# EasyEDA Pro project 金属疲劳控制系统.eprj

# Schematic Schematic1
Board Name: Board1; Create Date: 2025-07-17; Page Name: P1; Project Name: 金属疲劳控制系统; Schematic Name: Schematic1; Update Date: 2025-08-07; Company: 嘉立创EDA; Page Size: A4; Version: V1.0
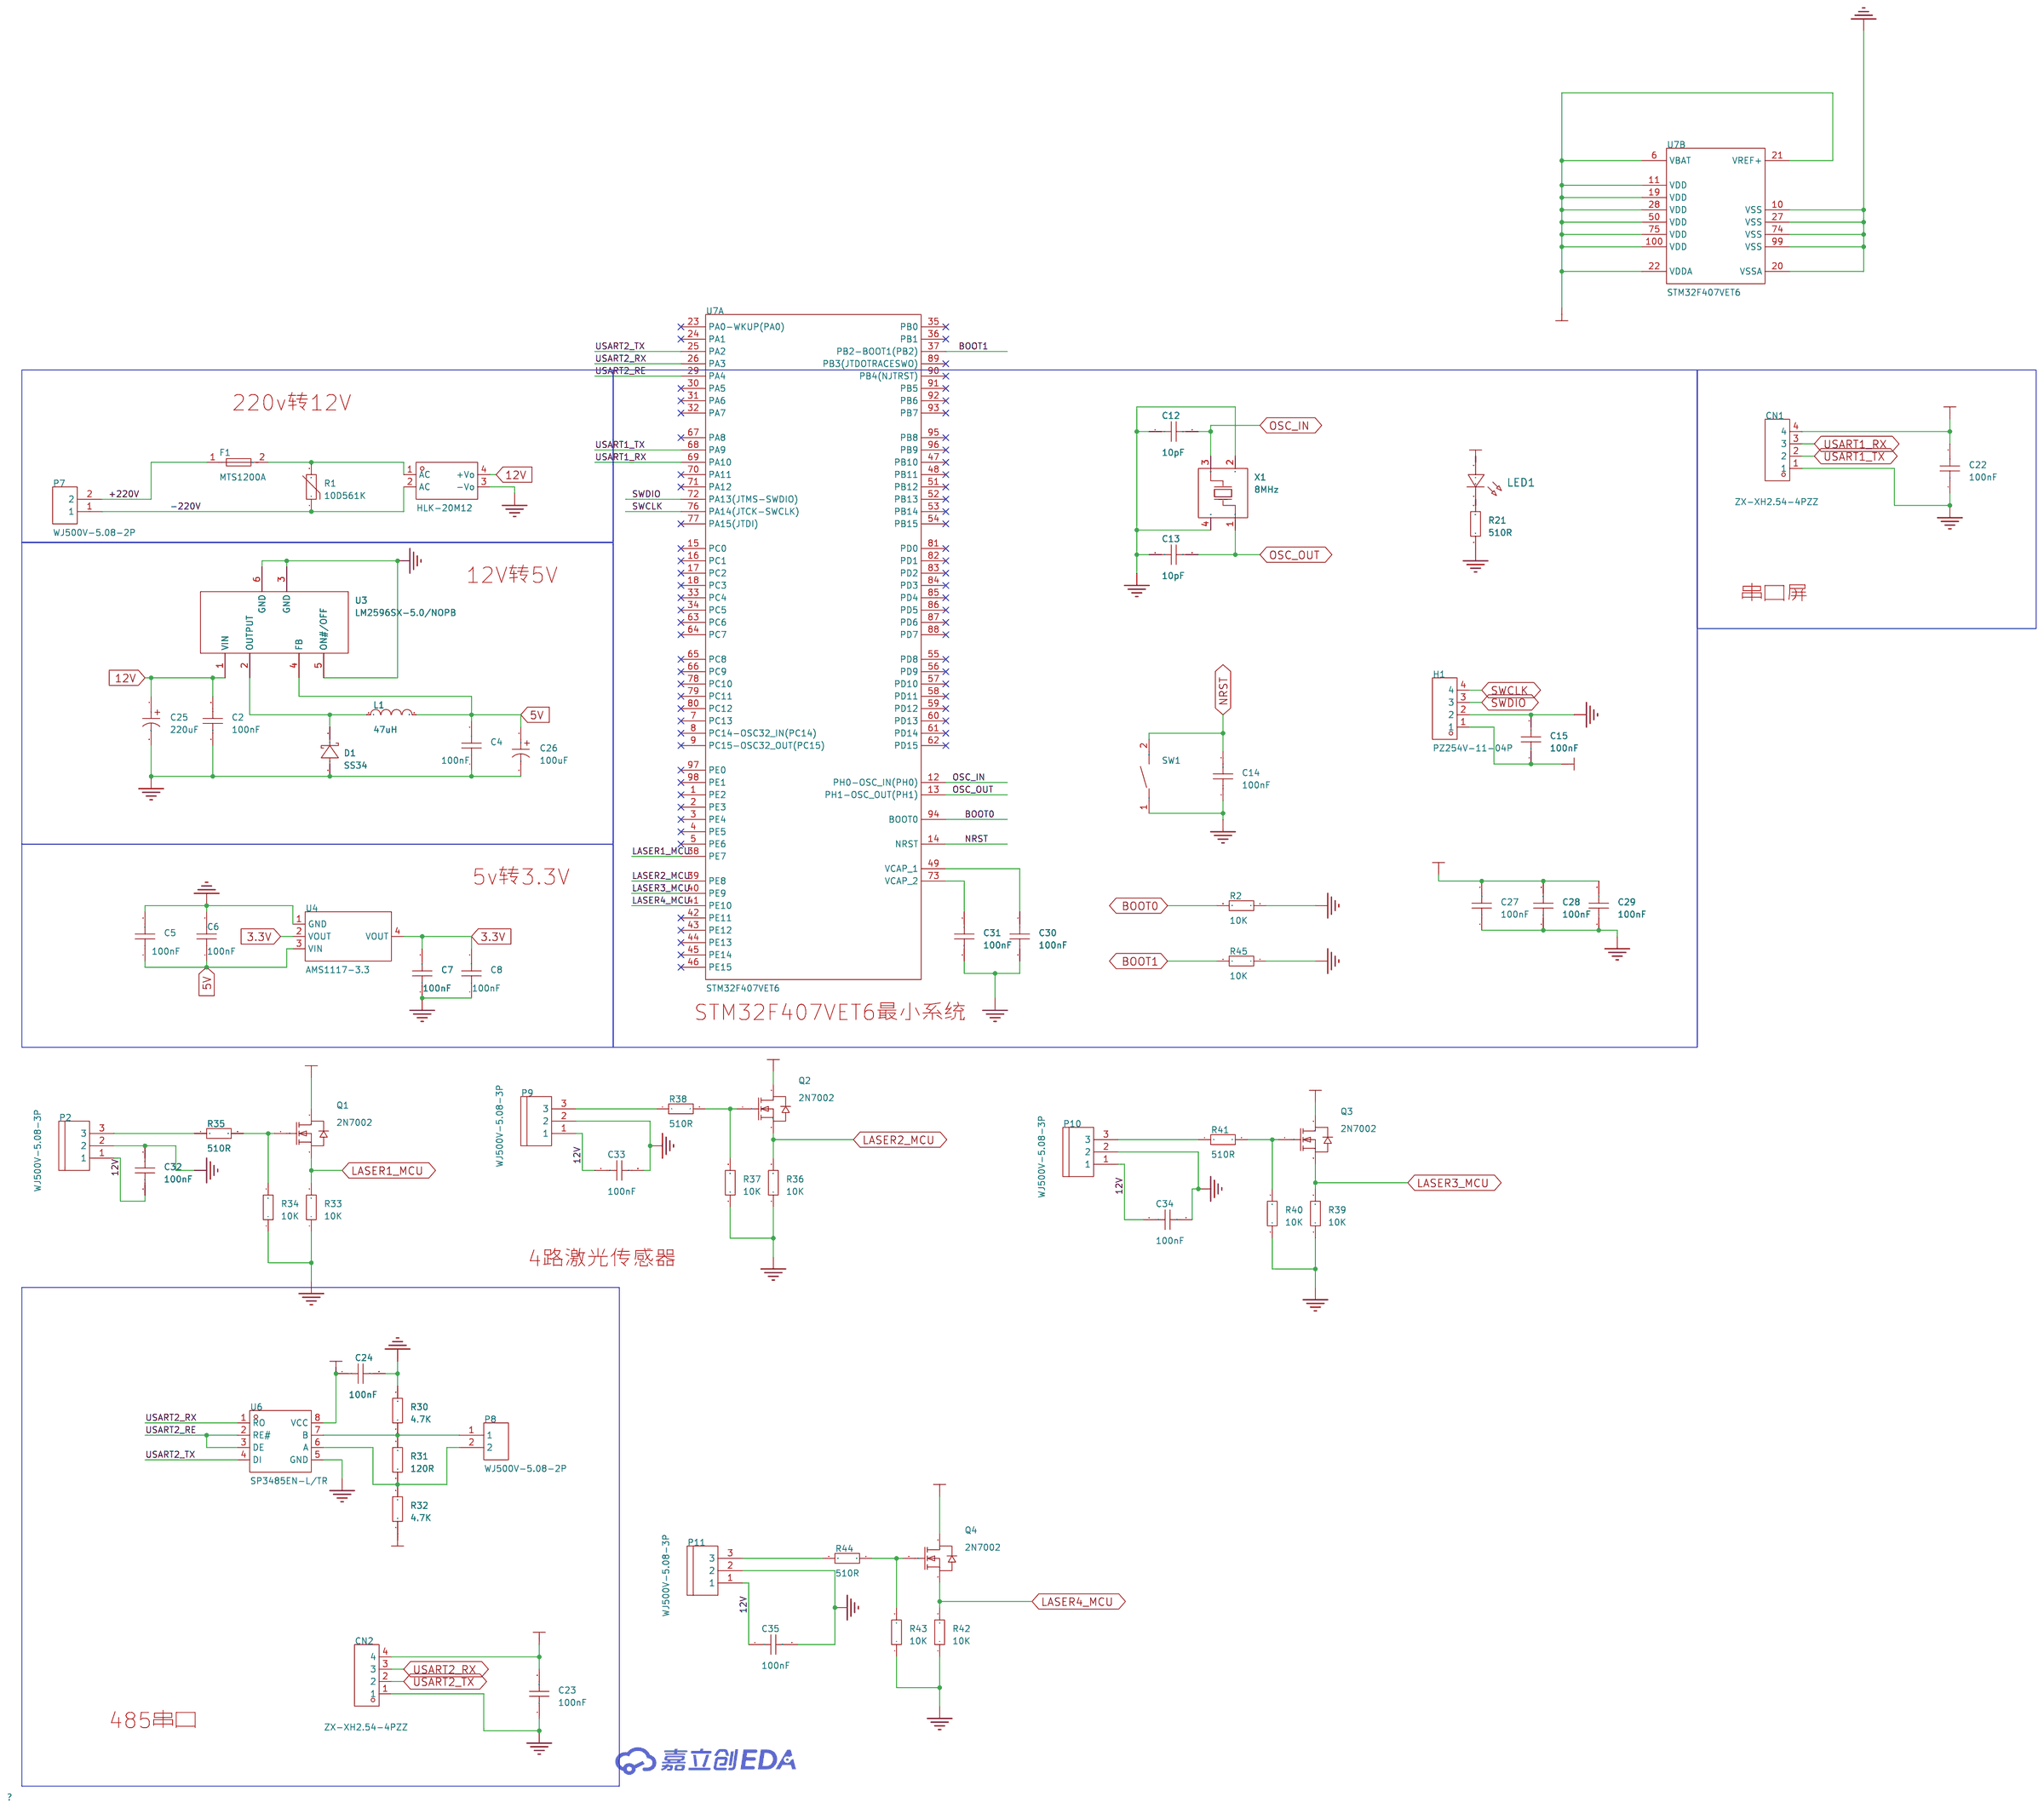
[diagram p0: schematic sheet]

## Parts
C2  100nF  [C0603]
C4  100nF  [C0603]
C5  100nF  [C0603]
C6  100nF  [C0603]
C7  100nF  [C0603]
C8  100nF  [C0603]
C12  10pF  [C0603]
C13  10pF  [C0603]
C14  100nF  [C0603]
C15  100nF  [C0603]
C22  100nF  [C0603]
C23  100nF  [C0603]
C24  100nF  [C0603]
C25  220uF  [CAP-SMD_BD8.0-L8.3-W8.3-FD]
C26  100uF  [CAP-SMD_BD6.3-L6.6-W6.6-FD-1]
C27  100nF  [C0603]
C28  100nF  [C0603]
C29  100nF  [C0603]
C30  100nF  [C0603]
C31  100nF  [C0603]
C32  100nF  [C0603]
C33  100nF  [C0603]
C34  100nF  [C0603]
C35  100nF  [C0603]
CN1  ZX-XH2.54-4PZZ  [CONN-TH_4P-P2.50_4PIN]
CN2  ZX-XH2.54-4PZZ  [CONN-TH_4P-P2.50_4PIN]
D1  SS34  [SMA_L4.3-W2.6-LS5.0-FD]
F1  MTS1200A  [FUSE-TH_L8.4-W4.0-P5.08-D0.6]
H1  PZ254V-11-04P  [HDR-TH_4P-P2.54-V-M]
L1  47uH  [IND-SMD_L12.0-W12.0]
LED1  -  [LED_0603]
P2  WJ500V-5.08-3P  [CONN-TH_3P-P5.00_WJ500V-5.08-3P]
P7  WJ500V-5.08-2P  [CONN-TH_2P-P5.00_WJ500V-5.08-2P]
P8  WJ500V-5.08-2P  [CONN-TH_2P-P5.00_WJ500V-5.08-2P]
P9  WJ500V-5.08-3P  [CONN-TH_3P-P5.00_WJ500V-5.08-3P]
P10  WJ500V-5.08-3P  [CONN-TH_3P-P5.00_WJ500V-5.08-3P]
P11  WJ500V-5.08-3P  [CONN-TH_3P-P5.00_WJ500V-5.08-3P]
Q1  2N7002  [SOT-23-3_L2.9-W1.3-P1.90-LS2.4-BR]
Q2  2N7002  [SOT-23-3_L2.9-W1.3-P1.90-LS2.4-BR]
Q3  2N7002  [SOT-23-3_L2.9-W1.3-P1.90-LS2.4-BR]
Q4  2N7002  [SOT-23-3_L2.9-W1.3-P1.90-LS2.4-BR]
R1  10D561K  [RES-TH_L12.5-W7.0-P7.50-D1.2-S7.00]
R2  10K  [R0603]
R21  510R  [R0603]
R30  4.7K  [R0603]
R31  120R  [R0603]
R32  4.7K  [R0603]
R33  10K  [R0603]
R34  10K  [R0603]
R35  510R  [R0603]
R36  10K  [R0603]
R37  10K  [R0603]
R38  510R  [R0603]
R39  10K  [R0603]
R40  10K  [R0603]
R41  510R  [R0603]
R42  10K  [R0603]
R43  10K  [R0603]
R44  510R  [R0603]
R45  10K  [R0603]
SW1  TS-1088-AR02016  [SW-SMD_L3.9-W3.0-P4.45]
U2  HLK-20M12  [PWRM-TH_HLK-20MXX]
U3  LM2596SX-5.0/NOPB  [TO-263-5_L10.2-W8.9-P1.70-TL]
U4  AMS1117-3.3  [SOT-223-3_L6.5-W3.4-P2.30-LS7.0-BR]
U6  SP3485EN-L/TR  [SOIC-8_L5.0-W4.0-P1.27-LS6.0-BL]
U7  STM32F407VET6  [LQFP-100_L14.0-W14.0-P0.50-LS16.0-BL]  (sections 1,2)
X1  8MHz  [CRYSTAL-SMD_4P-L3.2-W2.5-BL]

## Library data of the parts
C2 C4-C8 C12-C15 C22-C24 C27-C35 = CAP_0603: Supplier Footprint: 0603
C25 = GVT1V227M0810CNVC: 容值:220uF;精度:±20%;额定电压:35V;纹波电流:175mA@120Hz;; LCSC Part Name: 220uF ±20% 35V; Supplier Part: C2983323; Manufacturer: HRK(鸿瑞凯电子); Supplier Footprint: SMD,D8xL10.5mm; JLCPCB Part Class: 扩展库; Datasheet: https://atta.szlcsc.com/upload/public/pdf/source/20220321/BA17E910A44EA2B508CDD6AB8BA576BA.pdf; Supplier: LCSC; Tolerance: ±20%; Rated Voltage: 35V; Ripple Current: 175mA@120Hz; φD: 8mm; L: 10.5mm; Lifetime @ Temp: 2000hrs@105℃; Operating Temperature: -55℃~+105℃
C26 = JVJ25V100M6x5: 容值:100uF;精度:±20%;额定电压:25V;纹波电流:72mA@120Hz;; LCSC Part Name: 100uF ±20% 25V; Supplier Part: C46550402; Manufacturer: 捷而瑞; Supplier Footprint: SMD,D6.3xL5.4mm; JLCPCB Part Class: 扩展库; Datasheet: https://atta.szlcsc.com/upload/public/pdf/source/20250526/372E583B5965CEB57A276EA554306514.pdf; Supplier: LCSC; Tolerance: ±20%; Voltage Rating: 25V; Ripple Current: 72mA@120Hz; Diameter: 6.3mm; Height - Seated (Max): 5.4mm; Lifetime: 2000hrs@105℃; Operating Temperature: -55℃~+105℃
CN1 CN2 = ZX-XH2.54-4PZZ: 插针结构:1x4P;间距:2.5mm;安装方式:直插;参考系列:XH;总PIN数:4P;排数:1;每排PIN数:4;行距:-;额定电流:3A;触头材质:黄铜;触头镀层:锡;工作温度范围:-25℃~+85℃;; LCSC Part Name: 1x4P 间距:2.5mm 直插 系列:XH; Supplier Part: C7429634; Manufacturer: Megastar(兆星); Supplier Footprint: 插件,P=2.5mm; JLCPCB Part Class: 扩展库; Datasheet: https://atta.szlcsc.com/upload/public/pdf/source/20230619/B529A2163E0159A644AB3383D208FB03.pdf; Supplier: LCSC; Pins Structure: 1x4P; Pitch: 2.5mm; Mounting Type: 直插; Reference Series: XH; Number of Pins: 4P; Number of Rows: 1; Number of PINs Per Row: 4; Rated Current: 3A; Contact Material: 黄铜; Contact Plating: 锡; Operating Temperature: -25℃~+85℃; Rated Voltage (Max): 250V; Plastic Material: PA66; Flame Retardant Rating: UL94V-0; Color: 白色; Z-Height of the Board: 7mm; X-Length of Bottom Edge on Board (Spacing Line): 12.5mm; Y-Width of Bottom Edge on Board: 5.9mm
D1 = SS34_C7420365: 二极管配置:独立式;正向压降(Vf):550mV@3.0A;直流反向耐压(Vr):40V;平均整流电流(Io):3A;; LCSC Part Name: 电压:40V 电流:3A; Supplier Part: C7420365; Manufacturer: 宏迦橙; Supplier Footprint: SMA(DO-214AC); JLCPCB Part Class: 扩展库; Datasheet: https://atta.szlcsc.com/upload/public/pdf/source/20230828/75438452AEE6C276EDA92B2AF599BE05.pdf; Supplier: LCSC; Diode Configuration: 独立式; Forward Voltage (Vf@If): 550mV@3.0A; Reverse Voltage (Vr): 40V; Average Rectified Current (Io): 3A; Reverse Leakage Current (Ir): 200uA@40V; Peak forward surge current: 80A
F1 = MTS1200A: 类型:方形保险丝;额定电流:2A;; LCSC Part Name: 方形直插 慢断 250V 2A 保险丝; Supplier Part: C2762406; Manufacturer: Reomax(瑞迈); Supplier Footprint: 插件; JLCPCB Part Class: 扩展库; Datasheet: https://atta.szlcsc.com/upload/public/pdf/source/20210326/C2762413_8528218BDF91E47FC4A01F9F596C0CE3.pdf; Supplier: LCSC; Type: 方形保险丝; Current Rating: 2A
H1 = PZ254V-11-04P: 插针结构:1x4P;间距:2.54mm;行距:-;圆针/方针:方针;安装类型:直插;排数:单排;总PIN位数:4P;额定电流:3A;额定电压:250V;配合针长度:6mm;塑高:2.5mm;端接针长度:3mm;触头材质:-;工作温度范围:-40℃~+105℃;颜色:黑色;; LCSC Part Name: 间距:2.54mm 1x4P 直插 方针; Supplier Part: C2691448; Manufacturer: XFCN(兴飞); Supplier Footprint: 插件,P=2.54mm; JLCPCB Part Class: 扩展库; Datasheet: https://atta.szlcsc.com/upload/public/pdf/source/20200309/C492403_F9F19131791D08044AD4F84F8E751A34.pdf; Supplier: LCSC; Pin Structure: 1x4P; Pitch: 2.54mm; Circluar Pins/Square Pins: 方针; Mounting Type: 直插; Number of Rows: 单排; Number of Pins: 4P; Current Rating (Max): 3A; Voltage Rating (Max): 250V; Length of Mating Pin: 6mm; Insulation Height: 2.5mm; Length of End Connection Pin: 3mm; Operating Temperature Range: -40℃~+105℃; Color: 黑色
L1 = YPRH1209-470M: 电感值:47uH;精度:±20%;额定电流:3.6A;; LCSC Part Name: 47uH ±20%; Supplier Part: C339956; Manufacturer: YJYCOIN(益嘉源); Supplier Footprint: SMD,12x12mm; JLCPCB Part Class: 扩展库; Datasheet: https://atta.szlcsc.com/upload/public/pdf/source/20200623/C339955_D39FA66995A9BB8553FDBD7D9E6E5CB5.pdf; Supplier: LCSC; Tolerance: ±20%; Rated Current: 3.6A; DC Resistance (DCR): 63mΩ
LED1 = LED_0603-R: Supplier Footprint: 0603
P2 P9-P11 = WJ500V-5.08-3P: 结构:1x3P;间距:5.08mm;颜色:绿色;安装方式:直插;额定电流:18A;额定电压:250V;排数:1;线规 - AWG:14~30;线规 - 平方毫米:2.5;每排PIN数:3;工作温度范围:-40℃~+105℃;; LCSC Part Name: 5.08mm 1x3P 排数:1 每排P数:3 直插; Supplier Part: C72334; Manufacturer: KANGNEX(康奈克斯电气); Supplier Footprint: 插件,P=5.08mm; JLCPCB Part Class: 扩展库; Datasheet: https://atta.szlcsc.com/upload/public/pdf/source/20191225/C72334_8A5EF831D67650233B6B1E3F2BC06274.pdf; Supplier: LCSC; Structure: 1x3P; Pitch: 5.08mm; Color: 绿色; Mounting Style: 直插; Current Rating (Max): 18A; Voltage Rating (Max): 250V; Number of Pins: 3P; Number of Rows: 1; Wire Gauge - AWG: 14~30; Wire Gauge - mm2: 2.5; Number of PINs Per Row: 3; Operating Temperature Range: -40℃~+105℃
P7 P8 = WJ500V-5.08-2P: 结构:1x2P;间距:5.08mm;颜色:绿色;安装方式:直插;额定电流:18A;额定电压:250V;排数:1;线规 - AWG:14~30;线规 - 平方毫米:2.5;每排PIN数:2;触头材质:-;触头镀层:-;工作温度范围:-40℃~+105℃;焊接温度(最大值):-;; LCSC Part Name: 1x2P 5.08mm 直插 排数:1 每排P数:2; Supplier Part: C8465; Manufacturer: KANGNEX(康奈克斯电气); Supplier Footprint: 插件,P=5.08mm; JLCPCB Part Class: 扩展库; Datasheet: https://atta.szlcsc.com/upload/public/pdf/source/20191225/C8465_02D34CE5B5B4A53DF5891601D97FA9F4.pdf; Supplier: LCSC; Structure: 1x2P; Pitch: 5.08mm; Color: 绿色; Mounting Style: 直插; Current Rating (Max): 18A; Voltage Rating (Max): 250V; Number of Pins: 2P; Number of Rows: 1; Wire Gauge - AWG: 14~30; Wire Gauge - mm2: 2.5; Number of PINs Per Row: 2; Operating Temperature Range: -40℃~+105℃; Screw Specification: M2.5
Q1-Q4 = 2N7002_C7420321: 数量:1个N沟道;漏源电压(Vdss):60V;连续漏极电流(Id):115mA;导通电阻(RDS(on)):900mΩ@10V;耗散功率(Pd):225mW;阈值电压(Vgs(th)):1.6V@250uA;; LCSC Part Name: N沟道,电流:115mA,耐压:60V; Supplier Part: C7420321; Manufacturer: 宏嘉诚; Supplier Footprint: SOT-23; JLCPCB Part Class: 扩展库; Datasheet: https://atta.szlcsc.com/upload/public/pdf/source/20250624/B1032C791A504786E484C5C5C9138B03.pdf; Supplier: LCSC; Number: 1个N沟道; Drain to Source Voltage: 60V; Current - Continuous Drain(Id): 115mA; RDS(on): 900mΩ@10V; Pd - Power Dissipation: 225mW; Gate Threshold Voltage (Vgs(th)): 1.6V@250uA; Gate Charge(Qg): 1.6nC@10V; Input Capacitance(Ciss): 50pF; Reverse Transfer Capacitance (Crss@Vds): 5pF; Operating Temperature: -55℃~+150℃; Type: N沟道; Output Capacitance(Coss): 25pF
R1 = 10D561K_C233178: 压敏电压:504V~616V;钳位电压:920V;最大工作电压(DC):460V;最大工作电压(AC):350V;; LCSC Part Name: 钳位电压920V 42.3焦耳 插件压敏电阻; Supplier Part: C233178; Manufacturer: RUILON(瑞隆源); Supplier Footprint: 插件; JLCPCB Part Class: 扩展库; Datasheet: https://atta.szlcsc.com/upload/public/pdf/source/20180619/C233186_9A7AF57C0A178A4DEED9AC3F9621CA64.pdf; Supplier: LCSC; Varistor Voltage: 504V~616V; Clamping Voltage: 920V; Allowable Voltage (DC): 460V; Allowable Voltage (AC): 350V; Peak Current: 2.5kA; Maximum Energy: 42.3J; Typical Capatitance: 180pF@1kHz
R2 R21 R30-R45 = Res_0603: Supplier Footprint: 0603
SW1 = TS-1088-AR02016: 电路结构:单刀单掷;按钮形状:圆形按钮;作用力:160gf;安装方式:立贴;开关长度:4mm;开关宽度:3mm;开关高度:2mm;带支架:不带;触点电流:50mA;额定电压(DC):12V;绝缘电阻:100MΩ;机械寿命:10万次;; LCSC Part Name: 4*3*2mm 立贴 轻触开关; Supplier Part: C720477; Manufacturer: XUNPU(讯普); Supplier Footprint: SMD; JLCPCB Part Class: 基础库; Datasheet: https://atta.szlcsc.com/upload/public/pdf/source/20200810/C720475_60D09DD6C54279ADDB2DC25100F1CC11.pdf; Supplier: LCSC; Circuit: 单刀单掷; Actuator Style: 圆形按钮; Operating Force: 160gf; Mounting Style: 立贴; Switch Length: 4mm; Switch Width: 3mm; Switch Height: 2mm; Strike Gundam: 不带; Contact Current: 50mA; Voltage Rating (DC): 12V; Insulation Resistance: 100MΩ; Actuator/Cap Color: 黑色; Pin Style: SMD接片; Mechanical Life: 10万次; Operating Temperature: -30℃~+80℃
U2 = HLK-20M12: Supplier Part: C465408; Manufacturer: HI-LINK(海凌科); Supplier Footprint: 插件; JLCPCB Part Class: 扩展库; Datasheet: https://atta.szlcsc.com/upload/public/pdf/source/20191129/C465408_B4DB32B760893889245A0754E253364E.pdf; Supplier: LCSC
U3 = LM2596SX-5.0/NOPB: 功能类型:降压型;输出类型:固定;工作电压:4.5V~40V;输出电压:5V;输出电流:3A;; LCSC Part Name: LM2596 SIMPLE SWITCHER® 3A 降压电压调节器; Supplier Part: C10002; Manufacturer: TI(德州仪器); Supplier Footprint: TO-263-5; JLCPCB Part Class: 扩展库; Datasheet: https://www.ti.com/cn/lit/gpn/lm2596; Supplier: LCSC; Function: 降压型; Output Type: 固定; Voltage - Supply: 4.5V~40V; Output Voltage: 5V; Output Current: 3A; Frequency - Switching: 150kHz; Operating Temperature: -40℃~+125℃@(TJ); Synchronous Rectifier: 否; Number of Outputs: 1; Topology: 降压式; Switch tube (built-in/external): 内置
U4 = AMS1117-3.3_C6186: 输出类型:固定;工作电压:16V;输出电压:3.3V;输出电流:1A;电源纹波抑制比(PSRR):72dB@(120Hz);输出极性:正极;; LCSC Part Name: 输出3.3V 1A; Supplier Part: C6186; Manufacturer: AMS; Supplier Footprint: SOT-223; JLCPCB Part Class: 基础库; Datasheet: https://atta.szlcsc.com/upload/public/pdf/source/20180727/C6186_7A095716F0823C02F1997A905E26C086.pdf; Supplier: LCSC; Output Type: 固定; Voltage - Supply: 16V; Output Voltage: 3.3V; Output Current: 1A; Power Supply Rejection Ratio (PSRR): 72dB@(120Hz); Voltage Dropout: 1.1V@(800mA); standby current: 5mA; Features: 过流保护；过热保护; Operating Temperature: -40℃~+125℃; Output Configuration: 正极; Number of Outputs: 1
U6 = SP3485EN-L/TR: 类型:收发器;数据速率:10Mbps;; LCSC Part Name: SP3485 +3.3V低功耗半双工RS-485收发器，数据速率10Mbps; Supplier Part: C8963; Manufacturer: MaxLinear(迈凌); Supplier Footprint: SOIC-8; JLCPCB Part Class: 基础库; Datasheet: https://atta.szlcsc.com/upload/public/pdf/source/20170601/1496285796963.pdf; Supplier: LCSC; Types: 收发器; Number of Driver: 1; Number of receiver: 1; Supply Voltage: 3.3V; Data Rate: 10Mbps; Operating Temperature: -40℃~+85℃
U7 = STM32F407VET6: CPU内核:ARM-M4;CPU最大主频:168MHz;应用领域:-;; LCSC Part Name: 带DSP和FPU的高性能基础系列ARM Cortex-M4 MCU，具有512 KB Flash、168 MHz CPU、ART加速器、以太网和FSMC; Supplier Part: C28730; Manufacturer: ST(意法半导体); Supplier Footprint: LQFP-100(14x14); JLCPCB Part Class: 扩展库; Datasheet: https://atta.szlcsc.com/upload/public/pdf/source/20140801/1457707197138.pdf; Supplier: LCSC; CPU Core: ARM-M4; CPU Maximum Speed: 168MHz; Program Storage Size: 512KB; Program Memory Type: FLASH; Number of I/O: 82; ADC (Bit): 12bit; DAC (Bit): 12bit; Voltage - Supply: 1.8V~3.6V
X1 = X322525MOB4SI: 晶振类型:贴片晶振;频率:25MHz;常温频差:±10ppm;负载电容:12pF;频率稳定度:±20ppm;; LCSC Part Name: YSX321SL 25MHZ 4P 3225 12PF ±10PPM -40~85℃ (±20PPM); Supplier Part: C9006; Manufacturer: YXC(扬兴晶振); Supplier Footprint: SMD3225-4P; JLCPCB Part Class: 基础库; Datasheet: https://atta.szlcsc.com/upload/public/pdf/source/20240329/19D5F850207469550BEB00D7DFEDBC7A.pdf; Supplier: LCSC; Type: 贴片晶振; Normal temperature Frequency Tolerance: ±10ppm; Load Capacitance: 12pF; Frequency Stability: ±20ppm; Operating Temperature: -40℃~+85℃

## Nets
3.3V: C7.2 C8.2 C15.1 C23.2 C24.1 C27.2 C28.2 C29.2 CN2.4 H1.1 LED1.2(A) Q1.3(D) Q2.3(D) Q3.3(D) Q4.3(D) R32.1 U4.2(VOUT) U4.4(VOUT) U6.8(VCC) U7.6(VBAT) U7.11(VDD) U7.19(VDD) U7.21(VREF+) U7.22(VDDA) U7.28(VDD) U7.50(VDD) U7.75(VDD) U7.100(VDD)
5V: C4.2 C5.1 C6.1 C22.2 C26.1 CN1.4 L1.2 U3.4(FB) U4.3(VIN)
12V: C2.2 C25.1 C32.2 C33.1 C34.1 C35.1 P2.1 P9.1 P10.1 P11.1 U2.4(+Vo) U3.1(VIN)
+220V: F1.1 P7.2
-220V: P7.1 R1.1 U2.2(AC)
GND: C2.1 C4.1 C5.2 C6.2 C7.1 C8.1 C12.1 C13.1 C14.1 C15.2 C22.1 C23.1 C24.2 C25.2 C26.2 C27.1 C28.1 C29.1 C30.2 C31.2 C32.1 C33.2 C34.2 C35.2 CN1.1 CN2.1 D1.1(A) H1.2 P2.2 P9.2 P10.2 P11.2 R2.1 R21.1 R30.2 R33.1 R34.1 R36.1 R37.1 R39.1 R40.1 R42.1 R43.1 R45.1 SW1.1 U2.3(-Vo) U3.3(GND) U3.5(ON#/OFF) U3.6(GND) U4.1(GND) U6.5(GND) U7.10(VSS) U7.20(VSSA) U7.27(VSS) U7.74(VSS) U7.99(VSS) X1.2(GND) X1.4(GND)
BOOT0: R2.2 U7.94(BOOT0)
BOOT1: R45.2 U7.37(PB2-BOOT1(PB2))
LASER1_MCU: Q1.2(S) R33.2 U7.38(PE7)
LASER2_MCU: Q2.2(S) R36.2 U7.39(PE8)
LASER3_MCU: Q3.2(S) R39.2 U7.40(PE9)
LASER4_MCU: Q4.2(S) R42.2 U7.41(PE10)
NRST: C14.2 SW1.2 U7.14(NRST)
OSC_IN: C12.2 U7.12(PH0-OSC_IN(PH0)) X1.3(OSC2)
OSC_OUT: C13.2 U7.13(PH1-OSC_OUT(PH1)) X1.1(OSC1)
SWCLK: H1.4 U7.76(PA14(JTCK-SWCLK))
SWDIO: H1.3 U7.72(PA13(JTMS-SWDIO))
USART1_RX: CN1.3 U7.69(PA10)
USART1_TX: CN1.2 U7.68(PA9)
USART2_RE: U6.2(RE#) U6.3(DE) U7.29(PA4)
USART2_RX: CN2.3 U6.1(RO) U7.26(PA3)
USART2_TX: CN2.2 U6.4(DI) U7.25(PA2)
$1N1339: D1.2(K) L1.1 U3.2(OUTPUT)
$1N1822: F1.2 R1.2 U2.1(AC)
$1N5946: LED1.1(C) R21.2
$1N7709: P8.1 R30.1 R31.2 U6.7(B)
$1N7715: P8.2 R31.1 R32.2 U6.6(A)
$1N12949: P2.3 R35.1
$1N12954: Q1.1(G) R34.2 R35.2
$1N13186: P9.3 R38.1
$1N13193: Q2.1(G) R37.2 R38.2
$1N13466: P10.3 R41.1
$1N13473: Q3.1(G) R40.2 R41.2
$1N13948: Q4.1(G) R43.2 R44.2
$1N13952: P11.3 R44.1
$1N15549: C31.1 U7.73(VCAP_2)
$1N15554: C30.1 U7.49(VCAP_1)

Not connected (* = marked no-connect by the designer): U7 1(PE2)* 2(PE3)* 3(PE4)* 4(PE5)* 5(PE6)* 7(PC13)* 8(PC14-OSC32_IN(PC14))* 9(PC15-OSC32_OUT(PC15))* 15(PC0)* 16(PC1)* 17(PC2)* 18(PC3)* 23(PA0-WKUP(PA0))* 24(PA1)* 30(PA5)* 31(PA6)* 32(PA7)* 33(PC4)* 34(PC5)* 35(PB0)* 36(PB1)* 42(PE11)* 43(PE12)* 44(PE13)* 45(PE14)* 46(PE15)* 47(PB10)* 48(PB11)* 51(PB12)* 52(PB13)* 53(PB14)* 54(PB15)* 55(PD8)* 56(PD9)* 57(PD10)* 58(PD11)* 59(PD12)* 60(PD13)* 61(PD14)* 62(PD15)* 63(PC6)* 64(PC7)* 65(PC8)* 66(PC9)* 67(PA8)* 70(PA11)* 71(PA12)* 77(PA15(JTDI))* 78(PC10)* 79(PC11)* 80(PC12)* 81(PD0)* 82(PD1)* 83(PD2)* 84(PD3)* 85(PD4)* 86(PD5)* 87(PD6)* 88(PD7)* 89(PB3(JTDOTRACESWO))* 90(PB4(NJTRST))* 91(PB5)* 92(PB6)* 93(PB7)* 95(PB8)* 96(PB9)* 97(PE0)* 98(PE1)*

## Notes on the sheet
- 220v转12V
- 12V转5V
- 串口屏
- 5v转3.3V
- STM32F407VET6最小系统
- 4路激光传感器
- 485串口

# Board PCB1
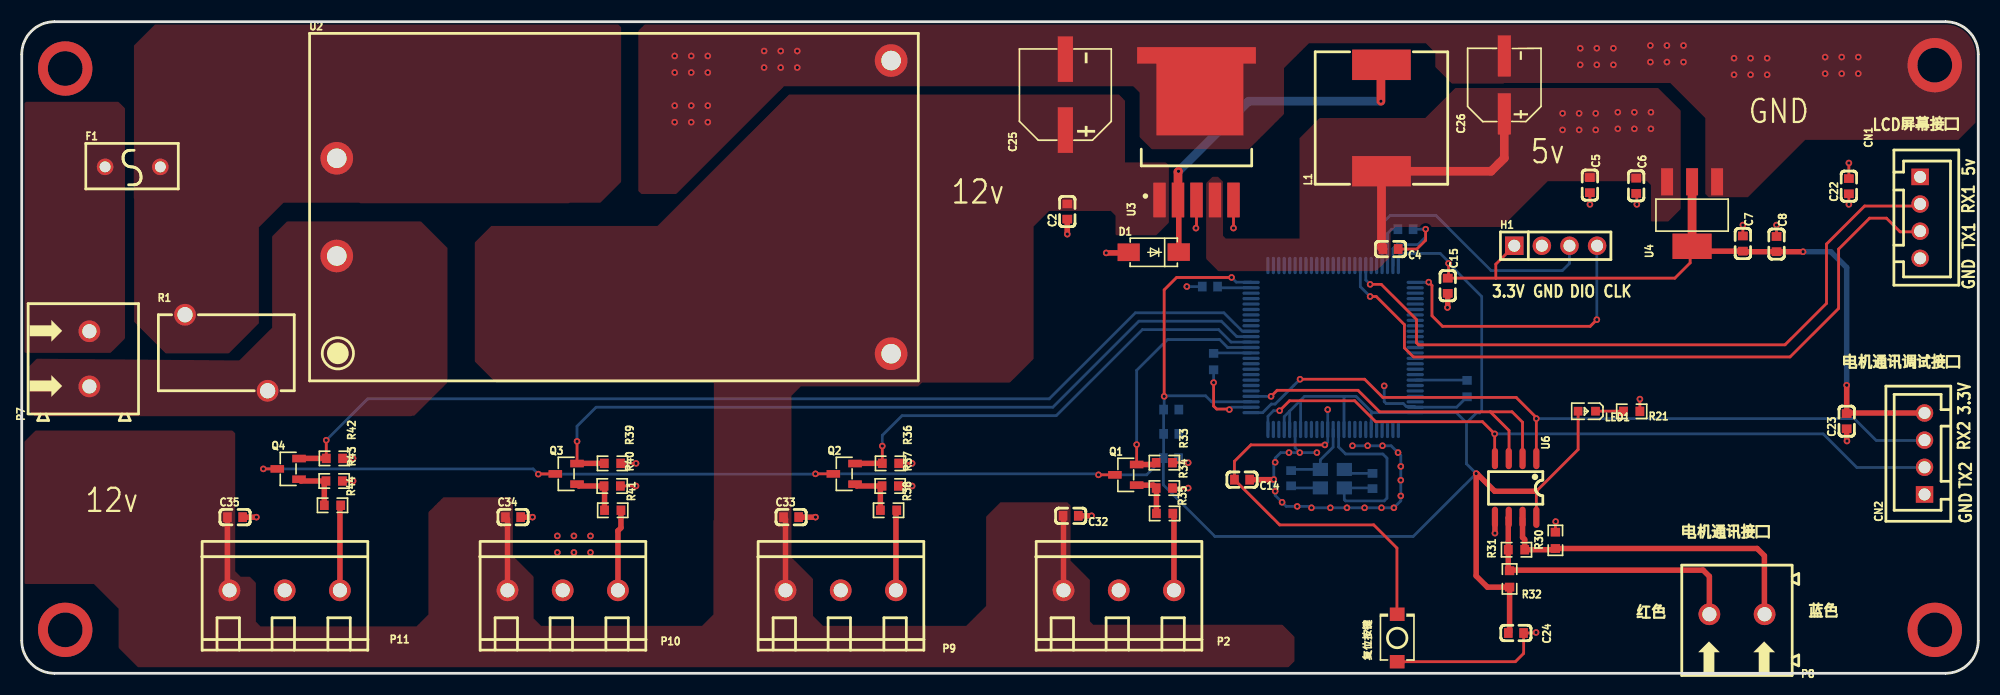
[diagram p1: board, top side]
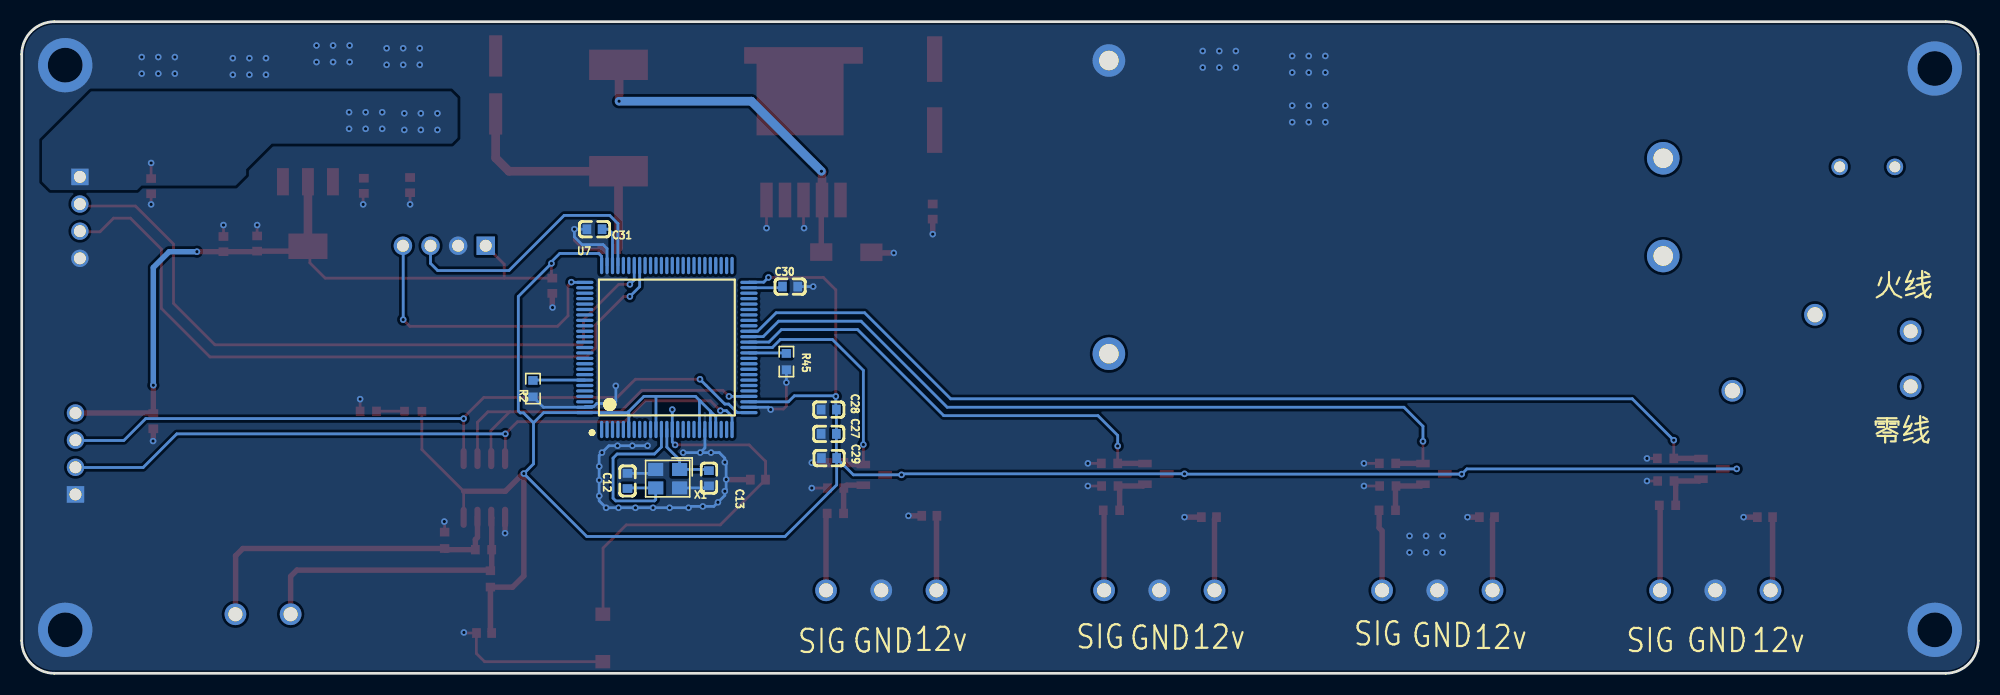
[diagram p2: board, bottom side, seen from below]

Outline 180 x 60 mm; copper layers: Top Layer, Bottom Layer. Coordinates in mm from the lower left corner of the outline.
Outline path: 0,57 0,3 arc(0.88,0.88) 3,0 177,0 arc(179.12,0.88) 180,3 180,57 arc(179.12,59.12) 177,60 3,60 arc(0.88,59.12) 0,57
Stack: Top Layer 0.035mm / Dielectric1 1.51mm FR4 er 4.5 / Bottom Layer 0.035mm

## Design rules (mm)
template: 自定义配置
spacing copperThickness1oz (default): track to track 0.102, other pairs 0.152 to 0.3
spacing copperThickness2oz: track to track 0.203, other pairs 0.152 to 0.3
track width copperThickness1oz (default): min 0.127, default 0.254, max 0.8
track width copperThickness2oz: min 0.203, default 0.254, max 10
differential pair differentialPair (default): width min 0.127, default 0.254, max 2.54; gap min 0.152, default 0.152
via viaSize (default): diameter min 0.5, default 0.61, max 10; hole min 0.3, default 0.305, max 6.3

## Placement (name value [footprint] x y rotation side)
C2  100nF  [C0603]  96.19 42.52 90 top
C4  100nF  [C0603]  125.93 39.06 180 top
C5  100nF  [C0603]  144.27 44.95 270 top
C6  100nF  [C0603]  148.53 44.89 270 top
C7  100nF  [C0603]  158.34 39.57 270 top
C8  100nF  [C0603]  161.44 39.52 270 top
C12  10pF  [C0603]  124.27 17.71 270 bottom
C13  10pF  [C0603]  116.78 17.96 90 bottom
C14  100nF  [C0603]  112.27 17.83 180 top
C15  100nF  [C0603]  131.19 35.69 270 top
C22  100nF  [C0603]  168.1 44.86 90 top
C23  100nF  [C0603]  167.89 23.22 90 top
C24  100nF  [C0603]  137.47 3.71 0 top
C25  220uF  [CAP-SMD_BD8.0-L8.3-W8.3-FD]  96.01 53.29 90 top
C26  100uF  [CAP-SMD_BD6.3-L6.6-W6.6-FD-1]  136.4 54.18 90 top
C27  100nF  [C0603]  105.75 22.05 180 bottom
C28  100nF  [C0603]  105.75 24.28 180 bottom
C29  100nF  [C0603]  105.73 19.81 180 bottom
C30  100nF  [C0603]  109.31 35.61 180 bottom
C31  100nF  [C0603]  127.31 40.89 0 bottom
C32  100nF  [C0603]  96.5 14.5 180 top
C33  100nF  [C0603]  70.78 14.38 0 top
C34  100nF  [C0603]  45.2 14.38 0 top
C35  100nF  [C0603]  19.62 14.38 0 top
CN1  ZX-XH2.54-4PZZ  [CONN-TH_4P-P2.50_4PIN]  174.65 41.96 270 top
CN2  ZX-XH2.54-4PZZ  [CONN-TH_4P-P2.50_4PIN]  175.06 20.22 90 top
D1  SS34  [SMA_L4.3-W2.6-LS5.0-FD]  104.14 38.78 0 top
F1  MTS1200A  [FUSE-TH_L8.4-W4.0-P5.08-D0.6]  10.21 46.63 0 top
H1  PZ254V-11-04P  [HDR-TH_4P-P2.54-V-M]  141.12 39.37 0 top
L1  47uH  [IND-SMD_L12.0-W12.0]  125.09 51.13 90 top
LED1  -  [LED_0603]  143.94 24.13 180 top
P2  WJ500V-5.08-3P  [CONN-TH_3P-P5.00_WJ500V-5.08-3P]  100.92 7.64 0 top
P7  WJ500V-5.08-2P  [CONN-TH_2P-P5.00_WJ500V-5.08-2P]  6.22 28.96 90 top
P8  WJ500V-5.08-2P  [CONN-TH_2P-P5.00_WJ500V-5.08-2P]  157.8 5.44 180 top
P9  WJ500V-5.08-3P  [CONN-TH_3P-P5.00_WJ500V-5.08-3P]  75.35 7.64 0 top
P10  WJ500V-5.08-3P  [CONN-TH_3P-P5.00_WJ500V-5.08-3P]  49.77 7.64 0 top
P11  WJ500V-5.08-3P  [CONN-TH_3P-P5.00_WJ500V-5.08-3P]  24.19 7.64 0 top
Q1  2N7002  [SOT-23-3_L2.9-W1.3-P1.90-LS2.4-BR]  101.57 18.27 0 top
Q2  2N7002  [SOT-23-3_L2.9-W1.3-P1.90-LS2.4-BR]  75.67 18.36 0 top
Q3  2N7002  [SOT-23-3_L2.9-W1.3-P1.90-LS2.4-BR]  50.09 18.36 0 top
Q4  2N7002  [SOT-23-3_L2.9-W1.3-P1.90-LS2.4-BR]  24.51 18.82 0 top
R1  10D561K  [RES-TH_L12.5-W7.0-P7.50-D1.2-S7.00]  18.82 29.52 0 top
R2  10K  [R0603]  132.97 26.21 90 bottom
R21  510R  [R0603]  148.12 24.12 180 top
R30  4.7K  [R0603]  141.1 12.24 90 top
R31  120R  [R0603]  137.52 11.38 0 top
R32  4.7K  [R0603]  136.88 8.69 90 top
R33  10K  [R0603]  105.12 19.39 180 top
R34  10K  [R0603]  105.12 17.05 180 top
R35  510R  [R0603]  105.14 14.72 180 top
R36  10K  [R0603]  79.92 19.33 180 top
R37  10K  [R0603]  79.9 17.25 180 top
R38  510R  [R0603]  79.75 15.01 180 top
R39  10K  [R0603]  54.35 19.33 180 top
R40  10K  [R0603]  54.32 17.25 180 top
R41  510R  [R0603]  54.37 15.01 180 top
R42  10K  [R0603]  28.77 19.79 180 top
R43  10K  [R0603]  28.74 17.7 180 top
R44  510R  [R0603]  28.59 15.47 180 top
R45  10K  [R0603]  109.65 28.7 90 bottom
U2  HLK-20M12  [PWRM-TH_HLK-20MXX]  54.48 42.93 0 top
U3  LM2596SX-5.0/NOPB  [TO-263-5_L10.2-W8.9-P1.70-TL]  108.08 48.59 90 top
U4  AMS1117-3.3  [SOT-223-3_L6.5-W3.4-P2.30-LS7.0-BR]  153.67 42.29 90 top
U6  SP3485EN-L/TR  [SOIC-8_L5.0-W4.0-P1.27-LS6.0-BL]  137.44 17.07 180 top
U7  STM32F407VET6  [LQFP-100_L14.0-W14.0-P0.50-LS16.0-BL]  120.65 30 180 bottom
X1  8MHz  [CRYSTAL-SMD_4P-L3.2-W2.5-BL]  120.57 17.92 0 bottom
复位按键  TS-1088-AR02016  [SW-SMD_L3.9-W3.0-P4.45]  126.54 3.25 90 top

## Footprints (pads in the part's own frame, mm; a bottom-side part is the same pattern mirrored in y, then rotated)
C0603
  rect 0.8x0.9 smd: 1(-0.7,0) 2(0.7,0)
CAP-SMD_BD6.3-L6.6-W6.6-FD-1
  rect 3.8x1.2 smd: 1(-2.67,0) 2(2.67,0)
CAP-SMD_BD8.0-L8.3-W8.3-FD
  rect 4.2x1.4 smd: 1(-3.267,0) 2(3.267,0)
CONN-TH_2P-P5.00_WJ500V-5.08-2P
  round 2 hole 1.3: 1(-2.54,0) 2(2.54,0)
CONN-TH_3P-P5.00_WJ500V-5.08-3P
  round 2 hole 1.3: 1(-5.08,0) 2(0,0) 3(5.08,0)
CONN-TH_4P-P2.50_4PIN
  rect 1.524x1.6 hole 1.1: 1(-3.75,0)
  round 1.6 hole 1.1: 2(-1.25,0) 3(1.25,0) 4(3.75,0)
CRYSTAL-SMD_4P-L3.2-W2.5-BL
  rect 1.4x1.2 smd: 1(-1.1,-0.85) 2(1.1,-0.85) 3(1.1,0.85) 4(-1.1,0.85)
FUSE-TH_L8.4-W4.0-P5.08-D0.6
  round 1.524 hole 1: 1(-2.54,0) 2(2.54,0)
HDR-TH_4P-P2.54-V-M
  rect 1.7x1.7 hole 1.1: 1(-3.81,0)
  round 1.7 hole 1.1: 2(-1.27,0) 3(1.27,0) 4(3.81,0)
IND-SMD_L12.0-W12.0
  rect 2.8x5.4 smd: 1(4.9,0) 2(-4.9,0)
LED_0603
  rect 0.8x0.8 smd: 1(-0.851,-0.01) 2(0.75,-0.005)
LQFP-100_L14.0-W14.0-P0.50-LS16.0-BL
  oval 0.3x1.6 smd: 1(-6,-7.55) 2(-5.5,-7.55) 3(-5,-7.55) 4(-4.5,-7.55) 5(-4,-7.55) 6(-3.5,-7.55) 7(-3,-7.55) 8(-2.5,-7.55) 9(-2,-7.55) 10(-1.5,-7.55) 11(-1,-7.55) 12(-0.5,-7.55) 13(0,-7.55) 14(0.5,-7.55) 15(1,-7.55) 16(1.5,-7.55) 17(2,-7.55) 18(2.5,-7.55) 19(3,-7.55) 20(3.5,-7.55) 21(4,-7.55) 22(4.5,-7.55) 23(5,-7.55) 24(5.5,-7.55) 25(6,-7.55) 51(6,7.55) 52(5.5,7.55) 53(5,7.55) 54(4.5,7.55) 55(4,7.55) 56(3.5,7.55) 57(3,7.55) 58(2.5,7.55) 59(2,7.55) 60(1.5,7.55) 61(1,7.55) 62(0.5,7.55) 63(0,7.55) 64(-0.5,7.55) 65(-1,7.55) 66(-1.5,7.55) 67(-2,7.55) 68(-2.5,7.55) 69(-3,7.55) 70(-3.5,7.55) 71(-4,7.55) 72(-4.5,7.55) 73(-5,7.55) 74(-5.5,7.55) 75(-6,7.55)
  oval 1.6x0.3 smd: 26(7.55,-6) 27(7.55,-5.5) 28(7.55,-5) 29(7.55,-4.5) 30(7.55,-4) 31(7.55,-3.5) 32(7.55,-3) 33(7.55,-2.5) 34(7.55,-2) 35(7.55,-1.5) 36(7.55,-1) 37(7.55,-0.5) 38(7.55,0) 39(7.55,0.5) 40(7.55,1) 41(7.55,1.5) 42(7.55,2) 43(7.55,2.5) 44(7.55,3) 45(7.55,3.5) 46(7.55,4) 47(7.55,4.5) 48(7.55,5) 49(7.55,5.5) 50(7.55,6) 76(-7.55,6) 77(-7.55,5.5) 78(-7.55,5) 79(-7.55,4.5) 80(-7.55,4) 81(-7.55,3.5) 82(-7.55,3) 83(-7.55,2.5) 84(-7.55,2) 85(-7.55,1.5) 86(-7.55,1) 87(-7.55,0.5) 88(-7.55,0) 89(-7.55,-0.5) 90(-7.55,-1) 91(-7.55,-1.5) 92(-7.55,-2) 93(-7.55,-2.5) 94(-7.55,-3) 95(-7.55,-3.5) 96(-7.55,-4) 97(-7.55,-4.5) 98(-7.55,-5) 99(-7.55,-5.5) 100(-7.55,-6)
PWRM-TH_HLK-20MXX
  round 3 hole 1.8: 1(-25.5,4.5) 2(-25.5,-4.5) 3(25.5,13.5) 4(25.5,-13.5)
R0603
  rect 0.806x0.864 smd: 1(-0.753,0) 2(0.753,0)
RES-TH_L12.5-W7.0-P7.50-D1.2-S7.00
  round 2 hole 1.4: 1(3.8,-3.5) 2(-3.8,3.5)
SMA_L4.3-W2.6-LS5.0-FD
  rect 2.046x1.62 smd: 1(-2.304,-0.009) 2(2.304,0.009)
SOIC-8_L5.0-W4.0-P1.27-LS6.0-BL
  oval 0.569x1.95 smd: 1(-1.905,-2.705) 2(-0.635,-2.705) 3(0.635,-2.705) 4(1.905,-2.705) 5(1.905,2.705) 6(0.635,2.705) 7(-0.635,2.705) 8(-1.905,2.705)
SOT-23-3_L2.9-W1.3-P1.90-LS2.4-BR
  rect 1.25x0.7 smd: 1(1,-0.95) 2(1,0.95) 3(-1,0)
SOT-223-3_L6.5-W3.4-P2.30-LS7.0-BR
  rect 2.5x1.1 smd: 1(2.97,-2.3) 2(2.97,0) 3(2.97,2.3)
  rect 2.34x3.6 smd: 4(-2.97,0)
SW-SMD_L3.9-W3.0-P4.45
  rect 1.23x1.36 smd: 1(-2.185,0) 2(2.185,0)
TO-263-5_L10.2-W8.9-P1.70-TL
  rect 3.2x1.15 smd: 1(-5.008,3.404) 2(-5.008,1.702) 3(-5.008,0) 4(-5.008,-1.702) 5(-5.008,-3.404)
  custom 8.128x10.922 smd: 6(5.008,-0.318)

## Nets
As in the schematic, except:
5V: C4.2 C5.1 C6.1 C22.2 C26.1 CN1.1 L1.2 U3.4 U4.3
GND: C2.1 C4.1 C5.2 C6.2 C7.1 C8.1 C12.1 C13.1 C14.1 C15.2 C22.1 C23.1 C24.2 C25.2 C26.2 C27.1 C28.1 C29.1 C30.2 C31.2 C32.1 C33.2 C34.2 C35.2 CN1.4 CN2.1 D1.1 H1.2 P2.2 P9.2 P10.2 P11.2 R2.1 R21.1 R30.2 R33.1 R34.1 R36.1 R37.1 R39.1 R40.1 R42.1 R43.1 R45.1 U2.3 U3.3 U3.5 U3.6 U4.1 U6.5 U7.10 U7.20 U7.27 U7.74 U7.99 X1.2 X1.4 复位按键.1
NRST: C14.2 U7.14 复位按键.2
USART1_RX: CN1.2 U7.69
USART1_TX: CN1.3 U7.68

Pads without a net: U7 1 2 3 4 5 7 8 9 15 16 17 18 23 24 30 31 32 33 34 35 36 42 43 44 45 46 47 48 51 52 53 54 55 56 57 58 59 60 61 62 63 64 65 66 67 70 71 77 78 79 80 81 82 83 84 85 86 87 88 89 90 91 92 93 95 96 97 98

## Via types
v1: diameter 0.61, hole 0.305, Top Layer to Bottom Layer, 141 vias
v2: diameter 5, hole 3.2, Top Layer to Bottom Layer, 4 vias

## Routing (per net, layer and track width the routed paths; a pad name or vN(x,y) marks a point on that pad's centre or on a via; arc(x,y) is an arc through that point)
3.3V: length 320.3
  Top Layer w0.254: Q4.3 v1(22.22,18.82) ; H1.1 135.61,37.67 135.61,36.39 ; v1(131.27,37.74) 131.27,36.46 C15.1 135.61,36.39 ; 143.19,24.13 143.19,20.61 139.34,16.76 U6.8 ; Q2.3 v1(73.03,18.36) ; Q1.3 v1(99.06,18.27) ; 135.61,36.39 152.08,36.39 153.49,37.8 153.49,39.14 U4.4 ; v1(105.1,25.5) 105.1,35.31 106.25,36.45 v1(111.3,36.45) ; v1(47.52,18.34) 47.55,18.36 Q3.3
  Top Layer w0.5: 136.76,3.71 136.88,3.82 R32.1 134.84,7.93 133.81,8.97 v1(133.81,18.39) 133.88,18.39 135.51,16.76 139.34,16.76 ; U4.4 154.12,38.87 C7.2 158.39,38.82 C8.2 v1(163.88,38.82) ; v1(167.89,26.52) C23.2 167.95,23.97 CN2.4
  Top Layer w0.8: U4.4 U4.2
  Bottom Layer w0.254: 116.65,24.14 117.59,25.09 ; 116.65,24.14 116.15,23.64 U7.22 ; 116.65,24.14 U7.21 ; 117.59,25.09 117.65,25.03 U7.19 ; 117.59,25.09 118.01,25.5 121.7,25.5 ; 121.7,25.5 121.65,25.45 U7.11 ; 121.7,25.5 122.76,25.5 124.15,24.11 ; v1(22.22,18.82) 47.04,18.82 v1(47.52,18.34) 73,18.34 v1(73.03,18.36) 98.97,18.36 v1(99.06,18.27) 103.49,18.27 C29.2 ; 132.92,23.06 133.83,23.98 134.14,23.98 134.32,24.16 134.32,34.69 v1(131.27,37.74) 131.27,37.9 130.5,38.66 126.92,38.66 126.65,38.39 U7.75 ; 132.92,23.06 131.98,24 U7.100 124.26,24 124.15,24.11 ; 132.92,23.06 132.92,19.28 v1(133.81,18.39) 128.02,12.6 109.78,12.6 105.03,17.35 C29.2 ; v1(111.3,36.45) 111.73,36.02 113.08,36.02 U7.50 ; U7.28 109.47,25 108.91,25.55 105.16,25.55 v1(105.1,25.5) 105.1,24.34 C28.2 105.05,22.05 C27.2 105.05,19.84 C29.2 ; 124.15,24.11 U7.6
  Bottom Layer w0.5: v1(167.89,26.52) 167.89,37.36 166.44,38.82 v1(163.88,38.82)
5V: length 24.5
  Top Layer w0.254: C22.2 v1(168.1,46.99)
  Top Layer w0.8: C26.1 136.4,47.45 135.18,46.23 L1.2 125.09,39.2 125.23,39.06
  vias: v1(141.76,51.56) v1(141.76,50.04) v1(143.28,51.56) v1(143.28,50.04) v1(144.81,51.56) v1(144.81,50.04) v1(146.84,51.66) v1(146.84,50.14) v1(148.36,51.66) v1(148.36,50.14) v1(149.89,51.66) v1(149.89,50.14)
12V: length 27.3
  Top Layer w0.5: P9.1 70.27,14.19 C33.1 ; C34.1 44.69,14.19 P10.1
  Top Layer w0.508: C32.2 95.84,14.46 P2.1 ; C35.1 18.92,7.83 P11.1
GND: length 117.9
  Top Layer w0.254: v1(129.16,40.89) 129.16,39.88 128.35,39.06 C4.1 ; R21.1 v1(148.87,25.25) ; v1(148.59,43.18) 148.59,44.13 C6.2 ; R40.1 v1(56.52,17.25) ; v1(108.03,41) 108.08,41.05 U3.3 ; C8.1 v1(161.44,41.27) ; R42.1 v1(30.48,19.79) ; R33.1 v1(107.31,19.39) ; v1(109.65,26.77) 109.65,24.61 109.93,24.33 111.05,24.33 v1(111.1,24.28) ; 复位按键.1 137.41,1.07 138.18,1.83 138.18,3.7 C24.2 139.27,3.71 v1(139.32,3.76) ; v1(141.12,13.97) 141.1,13.94 R30.2 ; C7.1 v1(158.34,41.27) ; R43.1 v1(30.48,17.7) ; R36.1 v1(81.91,19.33) ; R37.1 v1(81.91,17.25) ; C22.1 v1(168.1,43.18) ; R34.1 v1(107.31,17.05) ; U3.5 v1(111.48,41) ; C5.2 v1(144.27,43.18) ; R39.1 v1(56.52,19.33)
  Top Layer w0.5: v1(115.19,17.84) 115.18,17.83 C14.1 ; U6.5 v1(135.53,12.9) ; C15.2 131.19,33.71 v1(131.17,33.68) ; v1(167.92,21.39) 167.89,21.41 C23.1
  Top Layer w0.508: 71.48,14.38 v1(73.03,14.38) ; C34.2 v1(46.99,14.38) ; C32.1 v1(98.43,14.5) ; C35.2 v1(21.59,14.38) ; v1(99.77,38.71) 101.78,38.71 D1.1 ; C2.1 v1(96.19,40.44)
  Bottom Layer w0.254: v1(117.58,20.32) v1(116.59,20.32) 115.82,20.32 115.32,19.81 v1(115.32,19.43) 115.19,19.3 v1(115.19,17.84) 115.19,16.89 v1(115.32,16.76) 115.32,16.38 v1(115.95,15.75) 116.33,15.37 v1(117.34,15.37) 118.53,15.37 v1(118.65,15.24) v1(120.4,15.24) v1(121.92,15.24) v1(123.54,15.24) v1(125.09,15.24) v1(126.24,15.24) 126.87,15.88 v1(126.87,16.33) v1(126.87,17.78) v1(126.87,19.05) 126.87,20.07 v1(126.62,20.32) 125.98,20.95 v1(125.19,20.95) v1(123.82,20.95) v1(122.43,20.95) ; v1(117.58,20.32) 117.15,20.75 U7.20 ; v1(117.58,20.32) v1(119.15,20.32) ; X1.4 116.97,17.07 C13.1 ; U7.27 111.32,24.5 v1(111.1,24.28) ; C12.1 122.03,18.41 X1.2 ; R45.1 v1(109.65,26.77) ; v1(125.35,26.47) 125.35,25.02 125.53,24.84 127.1,24.84 127.37,24.57 128.13,24.57 U7.99 132.01,24.5 R2.1 ; U7.74 126.15,39.1 126.52,39.47 128.45,39.47 129.16,40.18 v1(129.16,40.89) C31.2 ; C30.2 v1(107.19,35.61)
  vias: v1(49.28,12.65) v1(49.28,11.12) v1(50.8,12.65) v1(50.8,11.12) v1(52.32,12.65) v1(52.32,11.12) v1(60.07,56.84) v1(60.07,55.32) v1(60.07,52.27) v1(60.07,50.75) v1(61.59,56.84) v1(61.59,55.32) v1(61.59,52.27) v1(61.59,50.75) v1(63.12,56.84) v1(63.12,55.32) v1(63.12,52.27) v1(63.12,50.75) v1(68.3,57.3) v1(68.3,55.78) v1(69.82,57.3) v1(69.82,55.78) v1(71.35,57.3) v1(71.35,55.78) v1(143.38,57.56) v1(143.38,56.03) v1(144.91,57.56) v1(144.91,56.03) v1(146.43,57.56) v1(146.43,56.03) v1(149.83,57.81) v1(149.83,56.29) v1(151.36,57.81) v1(151.36,56.29) v1(152.88,57.81) v1(152.88,56.29) v1(157.53,56.64) v1(157.53,55.12) v1(159.06,56.64) v1(159.06,55.12) v1(160.58,56.64) v1(160.58,55.12) v1(165.91,56.74) v1(165.91,55.22) v1(167.44,56.74) v1(167.44,55.22) v1(168.96,56.74) v1(168.96,55.22) v2(4,55.69) v2(4,4) v2(176,56) v2(176,4)
BOOT0: length 4.8
  Bottom Layer w0.254: U7.94 132.94,27 R2.2
BOOT1: length 3.5
  Bottom Layer w0.254: R45.2 109.7,29.5 U7.37
LASER1_MCU: length 22.5
  Top Layer w0.254: Q1.2 v1(102.57,21.06)
  Top Layer w0.5: Q1.2 104.2,19.22 R33.2
  Bottom Layer w0.254: U7.38 110.94,30 110.21,30.73 105.41,30.73 102.57,27.9 v1(102.57,21.06)
LASER2_MCU: length 43.5
  Top Layer w0.254: R36.2 v1(79.17,20.93)
  Top Layer w0.5: R36.2 76.68,19.33 Q2.2
  Bottom Layer w0.254: v1(79.17,20.93) 79.17,21.91 80.99,23.72 95.18,23.72 103.1,31.65 110.11,31.65 111.26,30.5 U7.39
LASER3_MCU: length 72.6
  Top Layer w0.254: Q3.2 v1(51.09,21.36)
  Top Layer w0.5: R39.2 51.1,19.33 Q3.2
  Bottom Layer w0.254: v1(51.09,21.36) 51.09,22.75 52.84,24.5 94.86,24.5 102.78,32.42 110.37,32.42 111.79,31 U7.40
LASER4_MCU: length 94.8
  Top Layer w0.254: v1(28.02,21.46) R42.2
  Top Layer w0.5: Q4.2 25.53,19.79 R42.2
  Bottom Layer w0.254: v1(28.02,21.46) 31.83,25.27 94.53,25.27 102.46,33.2 110.59,33.2 112.29,31.5 U7.41
NRST: length 37.7
  Top Layer w0.254: 复位按键.2 126.52,5.46 126.52,11.53 124.38,13.66 115.73,13.66 C14.2 111.57,19.52 113.08,21.03 v1(119.89,21.03)
  Bottom Layer w0.254: v1(120.15,24.28) U7.14 120.15,21.29 v1(119.89,21.03)
OSC_IN: length 18
  Bottom Layer w0.254: U7.12 121.15,20.84 121.79,20.19 125.22,20.19 125.6,19.81 125.6,16.13 125.35,15.88 121.79,15.88 121.67,15.99 X1.3 124.21,17.07 C12.2
OSC_OUT: length 6.9
  Bottom Layer w0.254: U7.13 120.65,20.83 119.47,19.65 X1.1 116.88,18.77 C13.2
SWCLK: length 27.1
  Top Layer w0.254: v1(144.91,32.56) 144.3,31.95 130.71,31.95 129.74,32.92 129.74,35.71 v1(129.44,36.02)
  Bottom Layer w0.254: v1(129.44,36.02) 129.42,36 U7.76 ; v1(144.91,32.56) 144.91,39.34 H1.4
SWDIO: length 25.4
  Bottom Layer w0.254: H1.3 142.39,37.74 141.73,37.08 135.18,37.08 130.1,42.16 125.91,42.16 125.15,41.41 U7.72
USART1_RX: length 64.6
  Top Layer w0.254: v1(124.05,35.81) 125.08,35.81 128.32,32.57 128.32,30.43 128.5,30.25 162.22,30.25 166.04,34.06 166.04,39.53 169.54,43.03 174.47,43.03 CN1.2
  Bottom Layer w0.254: U7.69 123.65,36.22 v1(124.05,35.81)
USART1_TX: length 66.4
  Top Layer w0.254: v1(124.05,34.7) 124.61,34.7 127.2,32.11 127.2,29.97 128.04,29.13 162.69,29.13 167.15,33.6 167.15,39.06 170,41.91 171.55,41.91 172.81,40.65 174.59,40.65 CN1.3
  Bottom Layer w0.254: U7.68 123.15,35.6 v1(124.05,34.7)
USART2_RE: length 34.8
  Top Layer w0.254: v1(114.94,25.5) 115.5,26.06 122.94,26.06 124.92,24.08 135.1,24.08 ; 135.1,24.08 136.83,22.35 136.83,19.8 U6.3 ; 135.1,24.08 137.11,24.08 138.07,23.11 U6.2
  Bottom Layer w0.254: U7.29 v1(114.94,25.5)
USART2_RX: length 69.3
  Top Layer w0.254: v1(117.6,27.08) 123.55,27.08 125.22,25.4 137.49,25.4 139.34,23.55 v1(139.34,23.45) U6.1
  Bottom Layer w0.254: v1(139.34,23.45) 168.59,23.45 170.61,21.44 175.03,21.44 CN2.3 ; v1(117.6,27.08) 117.04,26.52 115.32,24.79 114.96,24.79 114.17,24 U7.26
USART2_TX: length 67.1
  Top Layer w0.254: v1(115.72,24.18) 116.64,25.09 122.63,25.09 124.56,23.16 134.39,23.16 v1(135.51,22.05) 135.51,19.8 U6.4
  Bottom Layer w0.254: v1(115.72,24.18) 115.16,24.18 114.65,23.67 U7.25 ; v1(135.51,22.05) 165.74,22.05 168.83,18.95 175.04,18.95 CN2.2
$1N1339: length 32.2
  Top Layer w0.508: D1.2 106.44,43.51 U3.2
  Top Layer w0.8: v1(106.43,46.23) 106.38,46.18 U3.2 ; v1(125.04,52.68) 125.04,55.98 L1.1
  Bottom Layer w0.8: v1(125.04,52.68) 112.88,52.68 v1(106.43,46.23)
$1N5946: length 2.6
  Top Layer w0.254: LED1.1 147.34,24.14 R21.2
$1N7709: length 30.7
  Top Layer w0.5: 140.98,11.38 R31.2 138.27,12.31 138.07,12.51 U6.7 ; R30.1 159.66,11.49 160.32,10.82 160.32,5.45 P8.1 ; 141.03,11.33 140.98,11.38
$1N7715: length 27.1
  Top Layer w0.5: P8.2 155.26,8.92 154.69,9.5 136.94,9.5 R32.2 136.76,9.56 R31.1 136.76,14.32 U6.6
$1N12949: length 7.1
  Top Layer w0.5: R35.1 106,14.61 P2.3
$1N12954: length 4.3
  Top Layer w0.5: Q1.1 104.1,17.32 R34.2 104.39,17.03 104.39,14.72
$1N13186: length 7.4
  Top Layer w0.5: P9.3 80.43,14.94 R38.1
$1N13193: length 4.8
  Top Layer w0.5: Q2.1 76.83,17.25 R37.2 78.99,17.09 R38.2
$1N13466: length 7.5
  Top Layer w0.5: R41.1 55.13,13.39 54.85,13.12 P10.3
$1N13473: length 4.8
  Top Layer w0.5: Q3.1 51.25,17.25 R40.2 53.62,17.2 53.62,15.01
$1N13948: length 4.8
  Top Layer w0.5: R44.2 27.84,17.55 R43.2 25.68,17.7 Q4.1
$1N13952: length 7.9
  Top Layer w0.5: R44.1 29.27,15.4 P11.3
$1N15549: length 4.1
  Bottom Layer w0.254: 126.6,40.89 126.03,40.89 125.65,40.51 U7.73
$1N15554: length 3.1
  Bottom Layer w0.254: U7.49 110.12,35.5 C30.1

## Copper pours and planes (outline as drawn; the poured copper is in the pictures)
5V on Top Layer: 151.48,41.61 152.62,42.75 152.62,51.82 150.55,53.9 131.89,53.9 129.12,51.13 119.41,51.13 117.55,49.28 117.55,37.92 118.39,37.08 124.64,37.08 125.93,38.38 125.93,40.64 126.39,41.1 136.17,41.1 140.39,45.31 149.53,45.31 149.89,44.95 149.89,41.65 149.94,41.61
5V on Top Layer: 109.55,45.72 108.97,45.14 108.97,38.15 110.08,37.03 124.33,37.03 125.65,38.36 123.98,40.03 110.77,40.03 110.52,40.28 110.52,45.26 110.06,45.72
5V on Bottom Layer: 139.9,52.98 140.51,53.59 173.61,53.59 178.13,49.07 178.13,45.27 177.36,44.5 169.39,44.5 168.99,44.91 160.32,44.91 159.36,45.87 159.36,46.41 157,48.77 140.44,48.77 139.9,49.3
12V on Top Layer: 70.59,53.29 100.94,53.29 101.5,52.73 101.5,43.92 100.15,42.57 94.51,42.57 93.09,41.15 93.09,28.96 90.91,26.77 43.61,26.77 41.68,28.7 41.68,39.67 43.21,41.2 58.5,41.2
12V on Top Layer: 100.63,42.14 100.63,40.33 104.37,40.33 105.54,41.5 105.54,46.76 105.26,47.04 93.93,47.04 92.91,46.02 92.91,44.09 94.39,42.62 100.15,42.62
12V on Top Layer: 63.68,14.02 63.68,28.5 63.58,28.6 63.58,35.28 68.48,40.18 87.99,40.18 88.34,39.83 88.34,32.28 82.47,26.42 71.68,26.42 70.81,25.55 70.81,10.49 72.21,9.09 72.21,2.79 70.94,1.52 66.01,1.52 63.83,3.71 63.83,14 63.81,14.02
12V on Top Layer: 1.27,22.35 19.38,22.35 19.63,22.1 19.63,9.4 20.14,8.89 20.98,8.89 21.54,8.33 21.54,4.75 21.97,4.32 36.32,4.32 37.41,5.41 37.41,14.83 38.79,16.2 44.98,16.2 45.19,16 45.19,10.79 47.09,8.89 47.09,5.05 47.78,4.37 62.59,4.37 63.63,5.41 63.63,14.07 65.56,16 70.49,16 70.76,15.73 70.78,15.73 70.78,10.7 72.8,8.69 72.8,5.28 73.71,4.37 86.89,4.37 88.72,6.2 88.72,14.43 90.04,15.75 96.19,15.75 96.49,15.44 96.49,10.36 98.27,8.59 98.27,4.78 98.58,4.47 115.98,4.47 117.09,3.35 117.09,1.12 116.53,0.56 10.69,0.56 8.92,2.34 8.92,5.94 6.63,8.23 -0.18,8.23 -0.18,20.91
+220V on Top Layer: -0.03,29.82 -0.03,52.22 0.38,52.63 8.89,52.63 9.5,52.02 9.5,30.84 8.18,29.52 0.28,29.52
-220V on Top Layer: 1.38,28.97 1.38,28.97 0.71,28.3 0.71,24.16 1.19,23.67 35.86,23.67 39.11,26.93 34.7,31.34 22.76,31.34 20.22,28.8
-220V on Top Layer: 36.73,41.61 39.17,39.17 39.17,26.77 36.12,23.72 19.02,23.72 17.75,24.99 17.75,26.54 23.04,31.83 23.04,40.23 24.41,41.61
GND on Top Layer: 56.72,59.15 57.56,60 178.14,60 180,58.14 180,50.94 178.18,49.12 164.08,49.12 158.8,43.84 155.19,43.84 154.89,44.14 154.89,51.13 151.66,54.36 136.37,54.36 136.32,54.3 131.57,54.3 130.05,55.83 130.05,57.15 129.18,58.01 118.41,58.01 116.13,55.73 116.13,51.5 112.89,48.26 103.96,48.26 102.84,49.38 102.84,53.47 102.26,54.05 70.13,54.05 60.22,44.14 57,44.14 56.69,44.45 56.72,44.48
GND on Bottom Layer: -17.93,79.7 181.33,79.7 211.35,49.68 211.35,0.36 195.35,-15.65 -17.6,-15.65 -35.53,2.29 -35.53,62.1
$1N1822 on Top Layer: 10.32,48.14 10.32,57.81 12.52,60 54.63,60 55.14,59.49 55.14,45.24 53.24,43.33 24,43.33 23.39,42.72 11.33,42.72 10.31,43.74 10.31,48.13
$1N1822 on Top Layer: 12.17,49.99 10.34,48.16 10.34,32.37 13.25,29.46 19.05,29.46 21.82,32.23 21.82,41.07 24.18,43.43 30.99,43.43 31.14,43.28 50.32,43.28 55.09,48.06 55.09,55.58 52.2,58.47 13.23,58.47 12.06,57.3 12.06,50.09

Small or netless copper shapes (teardrops, artwork), in the pictures only: 1 on Top Layer

## Text on the board
Bottom Silkscreen Layer: 12v | GND | SIG | 火线 | 零线
Top Silkscreen Layer: RX2 | 3.3V | TX2 | GND | RX1 | 5v | TX1 | DIO | CLK | 12v | 红色 | 电机通讯接口 | 蓝色 | 电机通讯调试接口 | LCD屏幕接口
